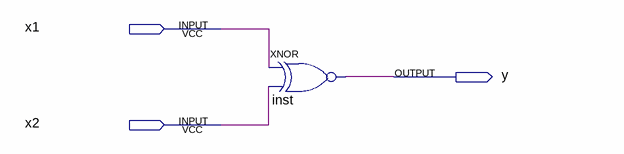
[diagram p0: schematic sheet]
// Quartus schematic lab16.bdf as structural Verilog: 1 symbols, 3 pins
module lab16 (
  input  x1,
  input  x2,
  output y
);

  xnor inst (y, x1, x2);
endmodule
